# EAGLE design hp_amp_mono (EAGLE 5.11)
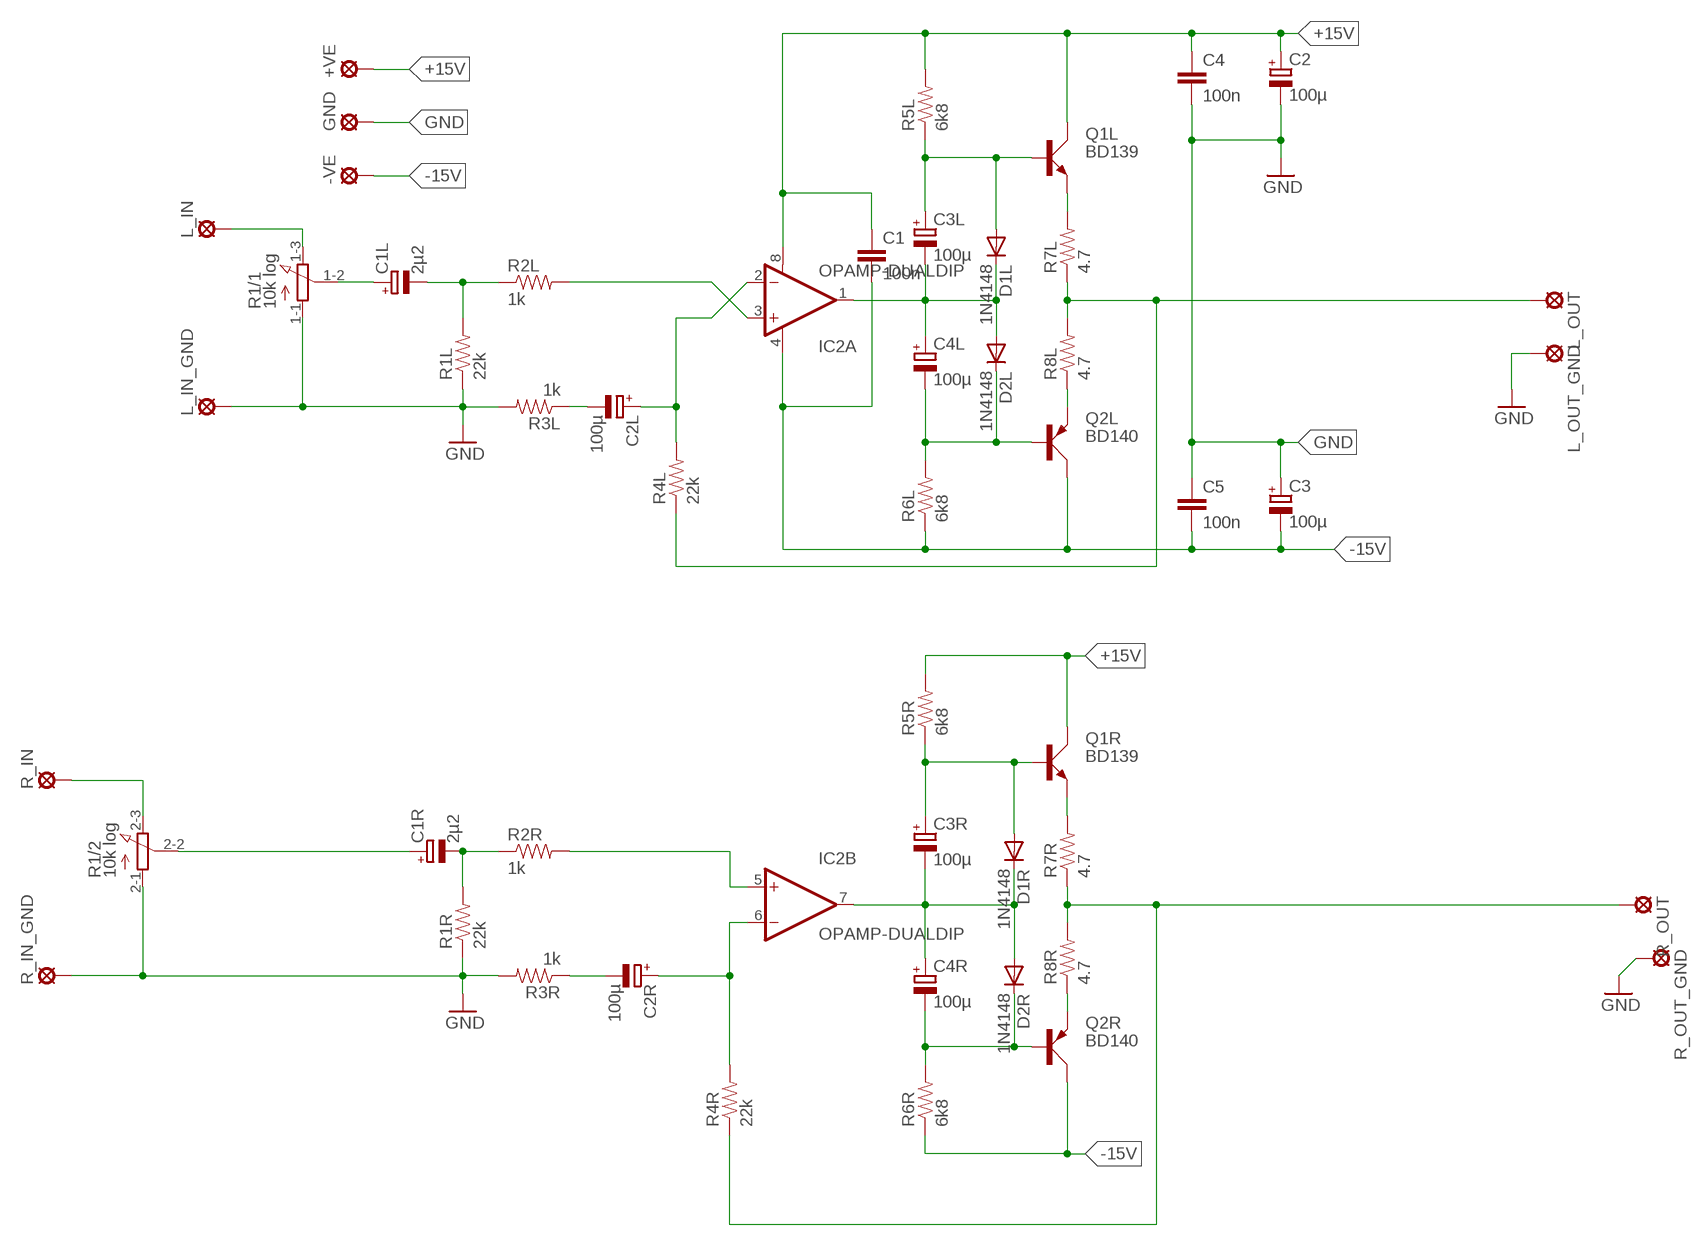
[diagram p0: schematic, sheet 1]

## Parts
+VE  LSP10  [LSP10]
-VE  LSP10  [LSP10]
C1  100n  CAP_  [AXIAL-5MM]
C1L  2µ2  CPOL-EUE2-4  [E2-4]
C1R  2µ2  CPOL-EUE2-4  [E2-4]
C2  100µ  CPOL-EUE3.5-8  [E3,5-8]
C2L  100µ  CPOL-EUE3.5-8  [E3,5-8]
C2R  100µ  CPOL-EUE3.5-8  [E3,5-8]
C3  100µ  CPOL-EUE3.5-8  [E3,5-8]
C3L  100µ  CPOL-EUE3.5-8  [E3,5-8]
C3R  100µ  CPOL-EUE3.5-8  [E3,5-8]
C4  100n  CAP_  [AXIAL-5MM]
C4L  100µ  CPOL-EUE3.5-8  [E3,5-8]
C4R  100µ  CPOL-EUE3.5-8  [E3,5-8]
C5  100n  CAP_  [AXIAL-5MM]
D1L  1N4148  1N4148DO35-7  [DO35-7]
D1R  1N4148  1N4148DO35-7  [DO35-7]
D2L  1N4148  1N4148DO35-7  [DO35-7]
D2R  1N4148  1N4148DO35-7  [DO35-7]
GND  LSP10  [LSP10]
IC2  OPAMP-DUALDIP  [DIP08]
L_IN  LSP10  [LSP10]
L_IN_GND  LSP10  [LSP10]
L_OUT  LSP10  [LSP10]
L_OUT_GND  LSP10  [LSP10]
Q1L  BD139  [TO126AV]
Q1R  BD139  [TO126AV]
Q2L  BD140  [TO126AV]
Q2R  BD140  [TO126AV]
R1  10k log  3RP/1610G  [3RP/1610G]
R1L  22k  RESISTORAXIAL-0.3  [AXIAL-0.3]
R1R  22k  RESISTORAXIAL-0.3  [AXIAL-0.3]
R2L  1k  RESISTORAXIAL-0.3  [AXIAL-0.3]
R2R  1k  RESISTORAXIAL-0.3  [AXIAL-0.3]
R3L  1k  RESISTORAXIAL-0.3  [AXIAL-0.3]
R3R  1k  RESISTORAXIAL-0.3  [AXIAL-0.3]
R4L  22k  RESISTORAXIAL-0.3  [AXIAL-0.3]
R4R  22k  RESISTORAXIAL-0.3  [AXIAL-0.3]
R5L  6k8  RESISTORAXIAL-0.3  [AXIAL-0.3]
R5R  6k8  RESISTORAXIAL-0.3  [AXIAL-0.3]
R6L  6k8  RESISTORAXIAL-0.3  [AXIAL-0.3]
R6R  6k8  RESISTORAXIAL-0.3  [AXIAL-0.3]
R7L  4.7  RESISTORAXIAL-0.3  [AXIAL-0.3]
R7R  4.7  RESISTORAXIAL-0.3  [AXIAL-0.3]
R8L  4.7  RESISTORAXIAL-0.3  [AXIAL-0.3]
R8R  4.7  RESISTORAXIAL-0.3  [AXIAL-0.3]
R_IN  LSP10  [LSP10]
R_IN_GND  LSP10  [LSP10]
R_OUT  LSP10  [LSP10]
R_OUT_GND  LSP10  [LSP10]

## Nets
+15V: +VE.MP C1.P$1 C2.+ C4.P$1 IC2.8(A:V+) Q1L.C Q1R.C R5L.P$2 R5R.P$2
-15V: -VE.MP C1.P$2 C3.- C5.P$2 IC2.4(A:V-) Q2L.C Q2R.C R6L.P$1 R6R.P$1
GND: C2.- C3.+ C4.P$2 C5.P$1 GND.MP L_IN_GND.MP L_OUT_GND.MP R1.1-1(/1:A) R1.2-1(/2:A) R1L.P$1 R1R.P$1 R3L.P$2 R3R.P$2 R_IN_GND.MP R_OUT_GND.MP
LOUT: L_OUT.MP R4L.P$1 R7L.P$1 R8L.P$2
N$1: C1R.+ R1.2-2(/2:S)
N$3: C1L.- R1L.P$2 R2L.P$1
N$4: C2L.- R3L.P$1
N$5: C2L.+ IC2.2(A:-IN) R4L.P$2
N$6: IC2.3(A:+IN) R2L.P$2
N$7: C1R.- R1R.P$2 R2R.P$1
N$8: C2R.- R3R.P$1
N$9: C3L.- C4L.+ D1L.C D2L.A IC2.1(A:OUT)
N$10: C3L.+ D1L.A Q1L.B R5L.P$1
N$11: C4L.- D2L.C Q2L.B R6L.P$2
N$12: Q1L.E R7L.P$2
N$13: C2R.+ IC2.6(B:-IN) R4R.P$2
N$14: Q2L.E R8L.P$1
N$15: IC2.5(B:+IN) R2R.P$2
N$16: C3R.- C4R.+ D1R.C D2R.A IC2.7(B:OUT)
N$17: C3R.+ D1R.A Q1R.B R5R.P$1
N$18: C4R.- D2R.C Q2R.B R6R.P$2
N$20: R4R.P$1 R7R.P$1 R8R.P$2 R_OUT.MP
N$21: Q2R.E R8R.P$1
N$22: Q1R.E R7R.P$2
N$23: C1L.+ R1.1-2(/1:S)
N$24: L_IN.MP R1.1-3(/1:E)
N$26: R1.2-3(/2:E) R_IN.MP

## Library data of the parts
+VE -VE GND L_IN L_IN_GND L_OUT L_OUT_GND R_IN R_IN_GND R_OUT R_OUT_GND = solpad:LSP10: SOLDER PAD drill 1.0 mm, distributor Buerklin, 12H555
C1 C4 C5 = sparkfun:CAP: Capacitor Standard 0603 ceramic capacitor, and 0.1" leaded capacitor.
C1L C1R C2 C2L C2R C3 C3L C3R C4L C4R = rcl:CPOL-EU: POLARIZED CAPACITOR, European symbol
D1L D1R D2L D2R = diode:1N4148: DIODE high speed (Philips)
IC2 = sparkfun:OPAMP-DUAL: Operational Amplifier
Q1L Q1R = transistor-power:BD139: NPN TRANSISTOR
Q2L Q2R = transistor-power:BD140: PNP TRANSISTOR
R1 = pot:3RP/1610G: 16mm Potentiometer two level Source: http://www.alphapotentiometers.net/html/16mm_pot_2.html
R1L R1R R2L R2R R3L R3R R4L R4R R5L R5R R6L R6R R7L R7R R8L R8R = sparkfun:RESISTOR: Resistor Basic schematic elements and footprints for 0603, 1206, and PTH resistors.

## Board
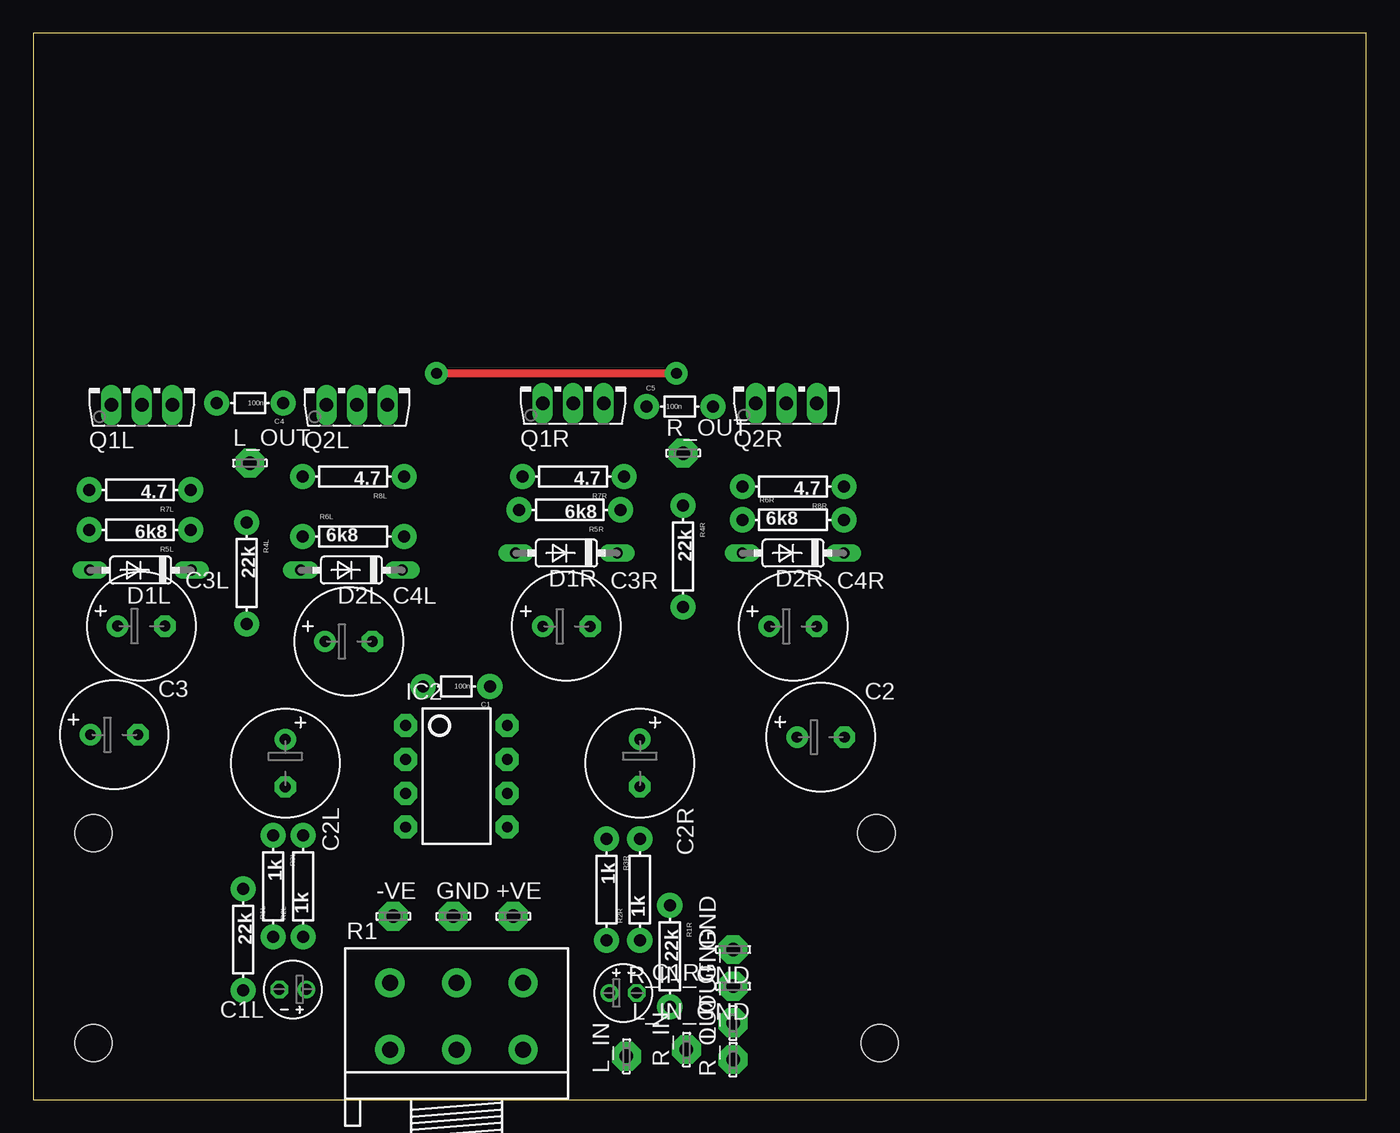
[diagram p1: board, top side]
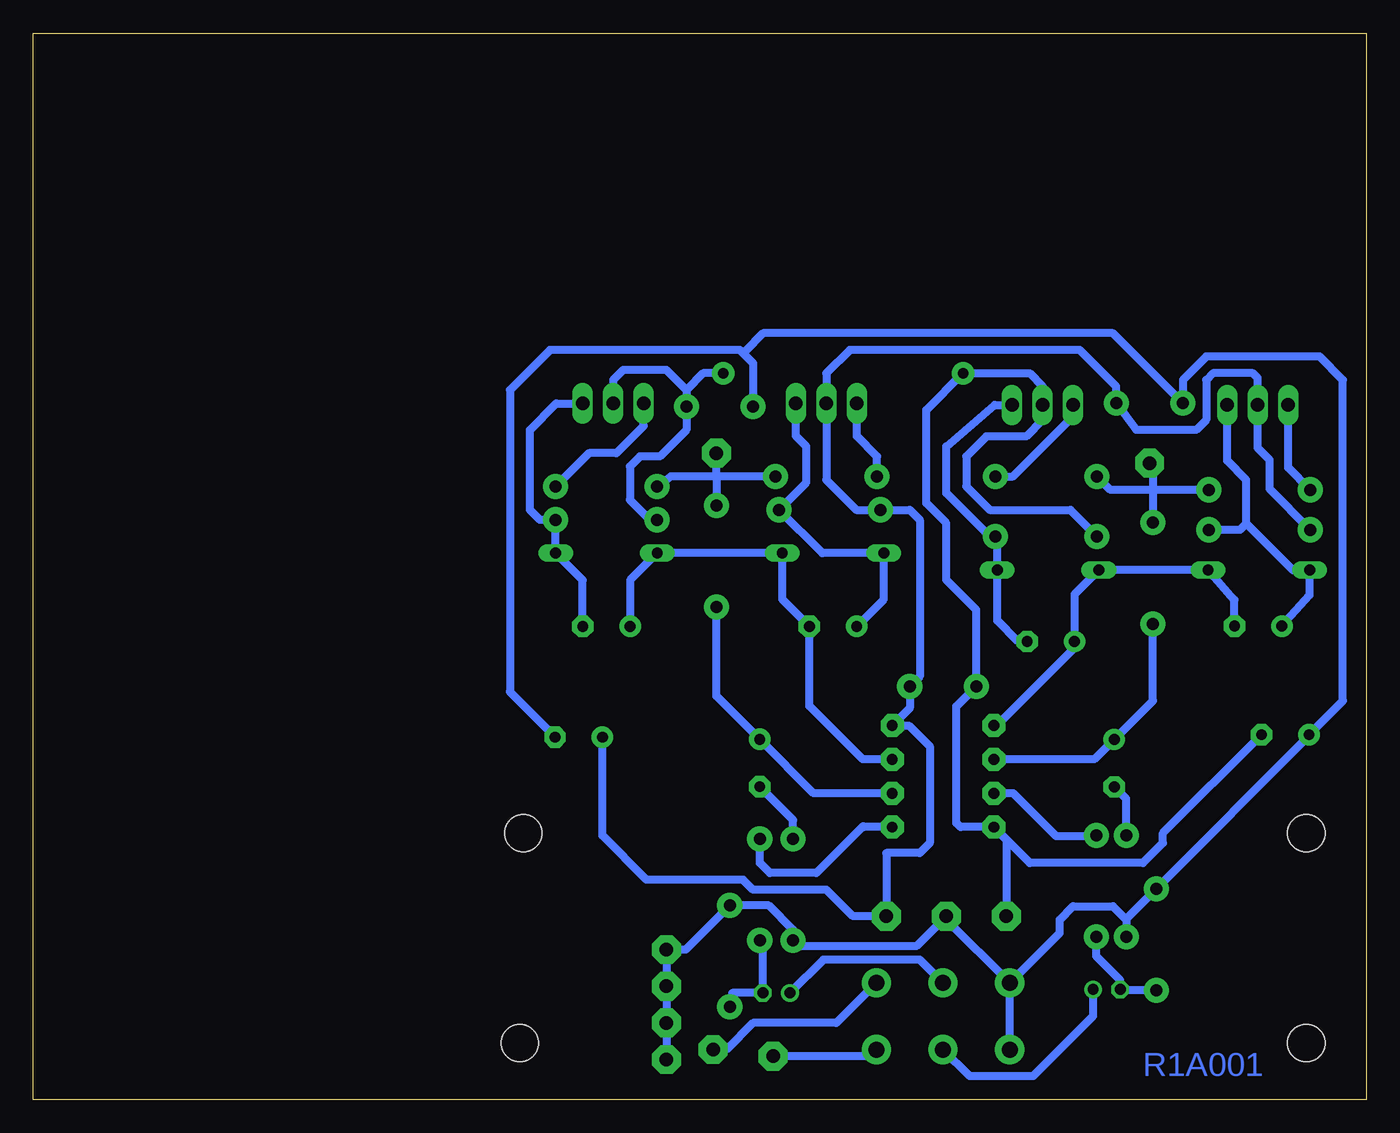
[diagram p2: board, bottom side, seen from below]

Size 100 x 80 mm. Coordinates in mm from the lower left corner, seen from the top.
Outline: 0,0 100,0 100,80 0,80 0,0
Copper layers (1*16): Top 0.035mm / dielectric 1.5mm / Bottom 0.035mm
Design rules "default *": minimum track width 16mil, minimum drill 24mil, track to track 8mil, track to pad 8mil, pad to pad 8mil, via to via 8mil, smd to smd 8mil, copper to edge 40mil, drill to drill 8mil, minimum pad ring 10mil, minimum via ring 8mil, stop-mask expansion 4mil, vias tented up to drill 0mil, thermal gap 10mil
Holes 2.8 mm at 4.5,4.25 63.5,4.25 63.25,20 4.5,20

### Footprints (pad centres in the part's own frame; a part is rotated, then mirrored left to right if it is on the bottom)
LSP10 = drill 1.016 pad 2.159 octagon: MP 0,0
AXIAL-5MM = drill 0.9 pad 1.88 round: P$1 -2.5,0; P$2 2.5,0
E2-4 = drill 0.813 pad 1.27 round: + -1.016,0 | drill 0.813 pad 1.27 octagon: - 1.016,0
E3,5-8 = drill 0.813 pad 1.6 round: + -1.778,0 | drill 0.813 pad 1.6 octagon: - 1.778,0
DO35-7 = drill 0.813 long: A 3.81,0; C -3.81,0
DIP08 = drill 0.813 pad 1.727 octagon: 1 -3.81,-3.81; 2 -1.27,-3.81; 3 1.27,-3.81; 4 3.81,-3.81; 5 3.81,3.81; 6 1.27,3.81; 7 -1.27,3.81; 8 -3.81,3.81
TO126AV = drill 1.016 long: B 2.286,-1.27; C 0,-1.27; E -2.286,-1.27
3RP/1610G = drill 1.2 pad 2.184 round: 1-1 -5,0; 1-2 0,0; 1-3 5,0; 2-1 -5,5; 2-2 0,5; 2-3 5,5
AXIAL-0.3 = drill 0.9 pad 1.88 round: P$1 -3.81,0; P$2 3.81,0

### Placement (x,y rotation side)
+VE  36,13.75 0 top
-VE  27,13.75 0 top
C1  31.75,31 180 top
C1L  19.47,8.26 180 top
C1R  44.25,8 0 top
C2  59.08,27.19 0 top
C2L  18.9,25.24 270 top
C2R  45.5,25.25 270 top
C3  6.07,27.37 0 top
C3L  8.1,35.52 0 top
C3R  40,35.5 0 top
C4  16.25,52.25 180 top
C4L  23.66,34.37 0 top
C4R  57,35.5 0 top
C5  48.5,52 0 top
D1L  8.05,39.72 180 top
D1R  40,41 180 top
D2L  23.87,39.72 180 top
D2R  57,41 180 top
GND  31.5,13.75 0 top
IC2  31.75,24.25 270 top
L_IN  44.5,3.25 90 top
L_IN_GND  52.5,8.5 180 top
L_OUT  16.25,47.75 0 top
L_OUT_GND  52.5,5.75 90 top
Q1L  8.14,53.38 0 top
Q1R  40.5,53.5 0 top
Q2L  24.28,53.38 0 top
Q2R  56.5,53.5 0 top
R1  31.75,3.75 0 top
R1L  15.75,12 270 top
R1R  47.75,10.75 270 top
R2L  20.25,16 90 top
R2R  45.5,15.75 90 top
R3L  18,16 270 top
R3R  43,15.75 270 top
R4L  16,39.5 270 top
R4R  48.75,40.75 270 top
R5L  8,42.75 180 top
R5R  40.25,44.25 180 top
R6L  24,42.25 0 top
R6R  57,43.5 0 top
R7L  8,45.75 180 top
R7R  40.5,46.75 180 top
R8L  24,46.75 180 top
R8R  57,46 180 top
R_IN  49,3.75 90 top
R_IN_GND  52.5,11.25 180 top
R_OUT  48.75,48.5 0 top
R_OUT_GND  52.5,3 90 top

### Tracks (layer width: path | path; a pad name or v marks a point on that pad's centre or on a via)
+15V
  Bottom 0.61: Q1L.C 8.14,53.64 | Q1L.C 8.14,48.89 7.25,48 7.25,45.81 R5L.P$2 | Q1L.C 8.14,54.14 8.5,54.5 11.5,54.5 12,54 12,51 12.75,50.25 17.25,50.25 C4.P$1 18.75,53.5 21.5,56.25 38.75,56.25 40.5,54.5 Q1R.C 40.5,46.5 38.25,44.25 R5R.P$2 34.25,44.25 33.5,43.5 33.5,31.75 C1.P$1 34.25,29.37 IC2.8 34.31,28.06 32.75,26.5 32.75,19.25 33.5,18.5 36,18.5 +VE.MP 38.5,13.75 40.5,15.75 46,15.75 46.75,16.5 54,16.5 57.3,19.8 C2.+
-15V  (via drill 0.8 pad 1.68)
  Top 0.61: v30.25,54.5 v48.25,54.5
  Bottom 0.61: R6L.P$1 22.19,44.25 28.25,44.25 30,46 30,48.25 28.5,49.75 25.5,49.75 24.28,50.97 Q2L.C 24.28,53.53 25.25,54.5 v30.25,54.5 33,51.75 33,44.75 31.5,43.25 31.5,39 29.25,36.75 C1.P$2 30.75,29.5 30.75,20.75 30.44,20.44 IC2.4 | Q2R.C 56.5,54 55.75,54.75 52.5,54.75 51,53.25 | 51,53.25 C5.P$2 51,50.25 53,48.25 54.5,48.25 55.25,47.5 55.25,45 53.75,43.5 R6R.P$1 | v48.25,54.5 49.75,54.5 51,53.25 | IC2.4 27.5,20 | IC2.4 27,19.5 -VE.MP | IC2.4 25.25,17.75 16.75,17.75 15.25,19.25 15.25,20 7.88,27.37 C3.-
GND
  Bottom 0.61: C5.P$1 46,55.25 46.88,56.12 | 46.88,56.12 47,56.25 61.25,56.25 64.25,53.25 64.25,30.58 C2.- | 46.88,56.12 46.62,56.12 45.25,57.5 19,57.5 C4.P$2 13.75,54 12,55.75 3.5,55.75 1.75,54 1.75,29.91 C3.+ 4.29,27.27 R1L.P$1 18,13.56 18,13.5 | R1.2-1 31.5,13.5 GND.MP 33.75,11.5 42.56,11.5 R3R.P$2 43,12.75 44.81,14.56 R1R.P$1 51.06,11.25 R_IN_GND.MP L_IN_GND.MP L_OUT_GND.MP R_OUT_GND.MP | R1.1-1 R1.2-1 | 18,13.5 R3L.P$2 | 18,13.5 19,14.5 22,14.5 23,13.5 23,12.5 R1.2-1
LOUT
  Bottom 0.61: R8L.P$2 19.19,45.75 16,45.75 | R7L.P$1 16,45.75 | 16,45.75 R4L.P$1 | L_OUT.MP 16,47.5 16,45.75
N$1
  Bottom 0.61: C1R.+ 40.73,10.5 33.5,10.5 R1.2-2
N$3
  Bottom 0.61: R2L.P$1 20.25,10.75 18.45,8.95 C1L.- 18.38,8.19 R1L.P$2
N$4
  Bottom 0.61: R3L.P$1 18,22.56 C2L.-
N$5
  Bottom 0.61: R4L.P$2 16,29.92 C2L.+ 20.4,25.52 IC2.2
N$6
  Bottom 0.61: IC2.3 26.48,22.98 23.25,19.75 20.31,19.75 R2L.P$2
N$7
  Bottom 0.61: R2R.P$1 45.27,11.71 C1R.- 47.56,8 R1R.P$2
N$8
  Bottom 0.61: C2R.- 43,20.97 R3R.P$1
N$9
  Bottom 0.61: C3L.- 9.88,37.49 D1L.C D2L.A 21.88,37.9 C4L.+ 21.88,33.87 27.69,28.06 IC2.1
N$10
  Bottom 0.61: C3L.+ 4.24,37.85 D1L.A 5.49,39.72 9,43.23 | Q1L.B 10.43,47.93 9,46.5 9,43.23 | 9,43.23 9.48,42.75 R5L.P$1
N$11
  Bottom 0.61: Q2L.B 27.89,52.11 31.5,49 31.5,45.5 28.25,42.25 R6L.P$2 27.68,42.12 D2L.C 27.68,35.93 26.12,34.37 C4L.-
N$12
  Bottom 0.61: R7L.P$2 5.85,47.41 Q1L.E
N$13
  Bottom 0.61: R4R.P$2 48.75,30.28 C2R.+ 41.45,22.98 IC2.6
N$14
  Bottom 0.61: Q2L.E 21.99,51.26 26.5,46.75 R8L.P$1
N$15
  Bottom 0.61: R2R.P$2 45.5,17.75 44.75,17 41.25,17 37.75,20.5 37.69,20.44 IC2.5
N$16
  Bottom 0.61: C4R.+ 55.22,38.97 D2R.A D1R.C 43.81,37.53 C3R.- 41.78,29.53 37.77,25.52 IC2.7
N$17
  Bottom 0.61: Q1R.B 42.79,49.79 42,49 42,46.31 R5R.P$1 40.81,41 D1R.A 36.19,37.53 C3R.+
N$18
  Bottom 0.61: C4R.- 58.78,38.97 D2R.C R6R.P$2 62,43.5 62.75,44.25 62.75,50.25 60.77,52.23 Q2R.B
N$20
  Bottom 0.61: 48.75,46.75 R4R.P$1 | R7R.P$1 48.75,46.75 | R8R.P$2 52.19,46.75 48.75,46.75 | 48.75,46.75 R_OUT.MP
N$21
  Bottom 0.61: 54.21,51.29 Q2R.E 54.21,50.54 56.25,48.5 58.31,48.5 R8R.P$1
N$22
  Bottom 0.61: Q1R.E 38.21,49.77 36.69,48.25 R7R.P$2
N$23
  Bottom 0.61: R1.1-2 29.75,1.75 25,1.75 20.49,6.26 C1L.+
N$24
  Bottom 0.61: L_IN.MP 37.25,3.25 R1.1-3
N$26
  Bottom 0.61: R_IN.MP 48,3.75 46,5.75 39.75,5.75 R1.2-3

### Text on the board
Bottom: R1A001